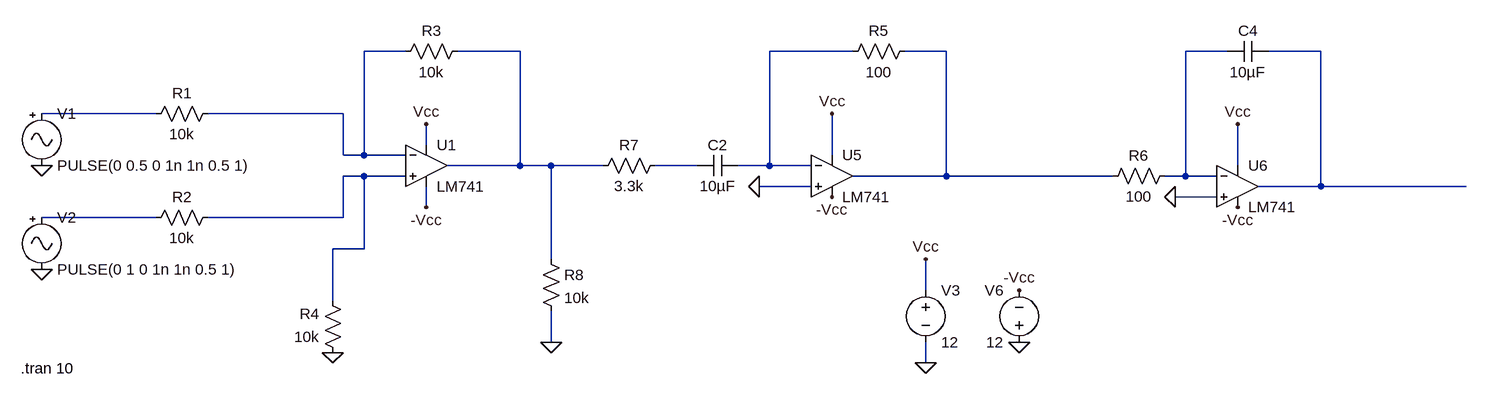
[diagram p0: schematic Draft1.asc]
Draft1.asc, the LTspice schematic file:
Version 4
SHEET 1 1620 708
WIRE -16 16 -80 16
WIRE 160 16 64 16
WIRE 672 16 544 16
WIRE 816 16 752 16
WIRE 1248 16 1184 16
WIRE 1392 16 1312 16
WIRE -400 112 -576 112
WIRE -112 112 -320 112
WIRE 16 160 16 128
WIRE -112 176 -112 112
WIRE -80 176 -80 16
WIRE -80 176 -112 176
WIRE -16 176 -80 176
WIRE 640 176 640 112
WIRE 160 192 160 16
WIRE 160 192 48 192
WIRE 208 192 160 192
WIRE 288 192 208 192
WIRE 432 192 368 192
WIRE 544 192 544 16
WIRE 544 192 496 192
WIRE 608 192 544 192
WIRE 1264 192 1264 128
WIRE -80 208 -112 208
WIRE -16 208 -80 208
WIRE 816 208 816 16
WIRE 816 208 672 208
WIRE 1072 208 816 208
WIRE 1184 208 1184 16
WIRE 1184 208 1152 208
WIRE 1232 208 1184 208
WIRE 608 224 528 224
WIRE 1392 224 1392 16
WIRE 1392 224 1296 224
WIRE 1616 224 1392 224
WIRE 1232 240 1168 240
WIRE 16 256 16 224
WIRE -400 272 -576 272
WIRE -112 272 -112 208
WIRE -112 272 -320 272
WIRE -80 320 -80 208
WIRE -80 320 -128 320
WIRE 208 336 208 192
WIRE 784 384 784 336
WIRE -128 400 -128 320
WIRE 208 464 208 416
WIRE 784 496 784 464
FLAG -576 192 0
FLAG -576 352 0
FLAG -128 480 0
FLAG 528 224 0
FLAG 1168 240 0
FLAG 16 128 Vcc
FLAG 16 256 -Vcc
FLAG 784 496 0
FLAG 928 464 0
FLAG 784 336 Vcc
FLAG 928 384 -Vcc
FLAG 640 112 Vcc
FLAG 640 240 -Vcc
FLAG 1264 128 Vcc
FLAG 1264 256 -Vcc
FLAG 208 464 0
SYMBOL Misc\\signal -576 96 R0
WINDOW 123 0 0 Left 0
WINDOW 39 0 0 Left 0
SYMATTR InstName V1
SYMATTR Value PULSE(0 0.5 0 1n 1n 0.5 1)
SYMBOL Misc\\signal -576 256 R0
WINDOW 123 0 0 Left 0
WINDOW 39 0 0 Left 0
SYMATTR InstName V2
SYMATTR Value PULSE(0 1 0 1n 1n 0.5 1)
SYMBOL res -304 96 R90
WINDOW 0 0 56 VBottom 2
WINDOW 3 32 56 VTop 2
SYMATTR InstName R1
SYMATTR Value 10k
SYMBOL res -304 256 R90
WINDOW 0 0 56 VBottom 2
WINDOW 3 32 56 VTop 2
SYMATTR InstName R2
SYMATTR Value 10k
SYMBOL res 80 0 R90
WINDOW 0 0 56 VBottom 2
WINDOW 3 32 56 VTop 2
SYMATTR InstName R3
SYMATTR Value 10k
SYMBOL res -112 496 R180
WINDOW 0 36 76 Left 2
WINDOW 3 36 40 Left 2
SYMATTR InstName R4
SYMATTR Value 10k
SYMBOL cap 496 176 R90
WINDOW 0 0 32 VBottom 2
WINDOW 3 32 32 VTop 2
SYMATTR InstName C2
SYMATTR Value 10µF
SYMBOL res 768 0 R90
WINDOW 0 0 56 VBottom 2
WINDOW 3 32 56 VTop 2
SYMATTR InstName R5
SYMATTR Value 100
SYMBOL res 1168 192 R90
WINDOW 0 0 56 VBottom 2
WINDOW 3 32 56 VTop 2
SYMATTR InstName R6
SYMATTR Value 100
SYMBOL cap 1312 0 R90
WINDOW 0 0 32 VBottom 2
WINDOW 3 32 32 VTop 2
SYMATTR InstName C4
SYMATTR Value 10µF
SYMBOL LM741 640 144 R0
SYMATTR InstName U5
SYMBOL LM741 1264 160 R0
SYMATTR InstName U6
SYMBOL LM741 16 128 R0
SYMATTR InstName U1
SYMBOL voltage 784 368 R0
WINDOW 123 0 0 Left 0
WINDOW 39 0 0 Left 0
SYMATTR InstName V3
SYMATTR Value 12
SYMBOL voltage 928 480 R180
WINDOW 0 24 96 Left 2
WINDOW 3 24 16 Left 2
WINDOW 123 0 0 Left 0
WINDOW 39 0 0 Left 0
SYMATTR InstName V6
SYMATTR Value 12
SYMBOL res 384 176 R90
WINDOW 0 0 56 VBottom 2
WINDOW 3 32 56 VTop 2
SYMATTR InstName R7
SYMATTR Value 3.3k
SYMBOL res 192 320 R0
SYMATTR InstName R8
SYMATTR Value 10k
TEXT -608 504 Left 2 !.tran 10

The netlist it stands for:
* Draft1.asc
V1 N007 0 PULSE(0 0.5 0 1n 1n 0.5 1)
V2 N010 0 PULSE(0 1 0 1n 1n 0.5 1)
R1 N001 N007 10k
R2 N009 N010 10k
R3 N002 N001 10k
R4 0 N009 10k
C2 N003 N008 10µF
R5 N004 N003 100
R6 N005 N004 100
C4 N006 N005 10µF
XU5 0 N003 Vcc -Vcc N004 LM741  ; pins In+ In- V+ V- OUT
XU6 0 N005 Vcc -Vcc N006 LM741  ; pins In+ In- V+ V- OUT
XU1 N009 N001 Vcc -Vcc N002 LM741  ; pins In+ In- V+ V- OUT
V3 Vcc 0 12
V6 0 -Vcc 12
R7 N008 N002 3.3k
R8 N002 0 10k
.tran 10
.lib LM741.lib
.backanno
.end